# EAGLE design PCA9546 Breakout (EAGLE 9.6.2)
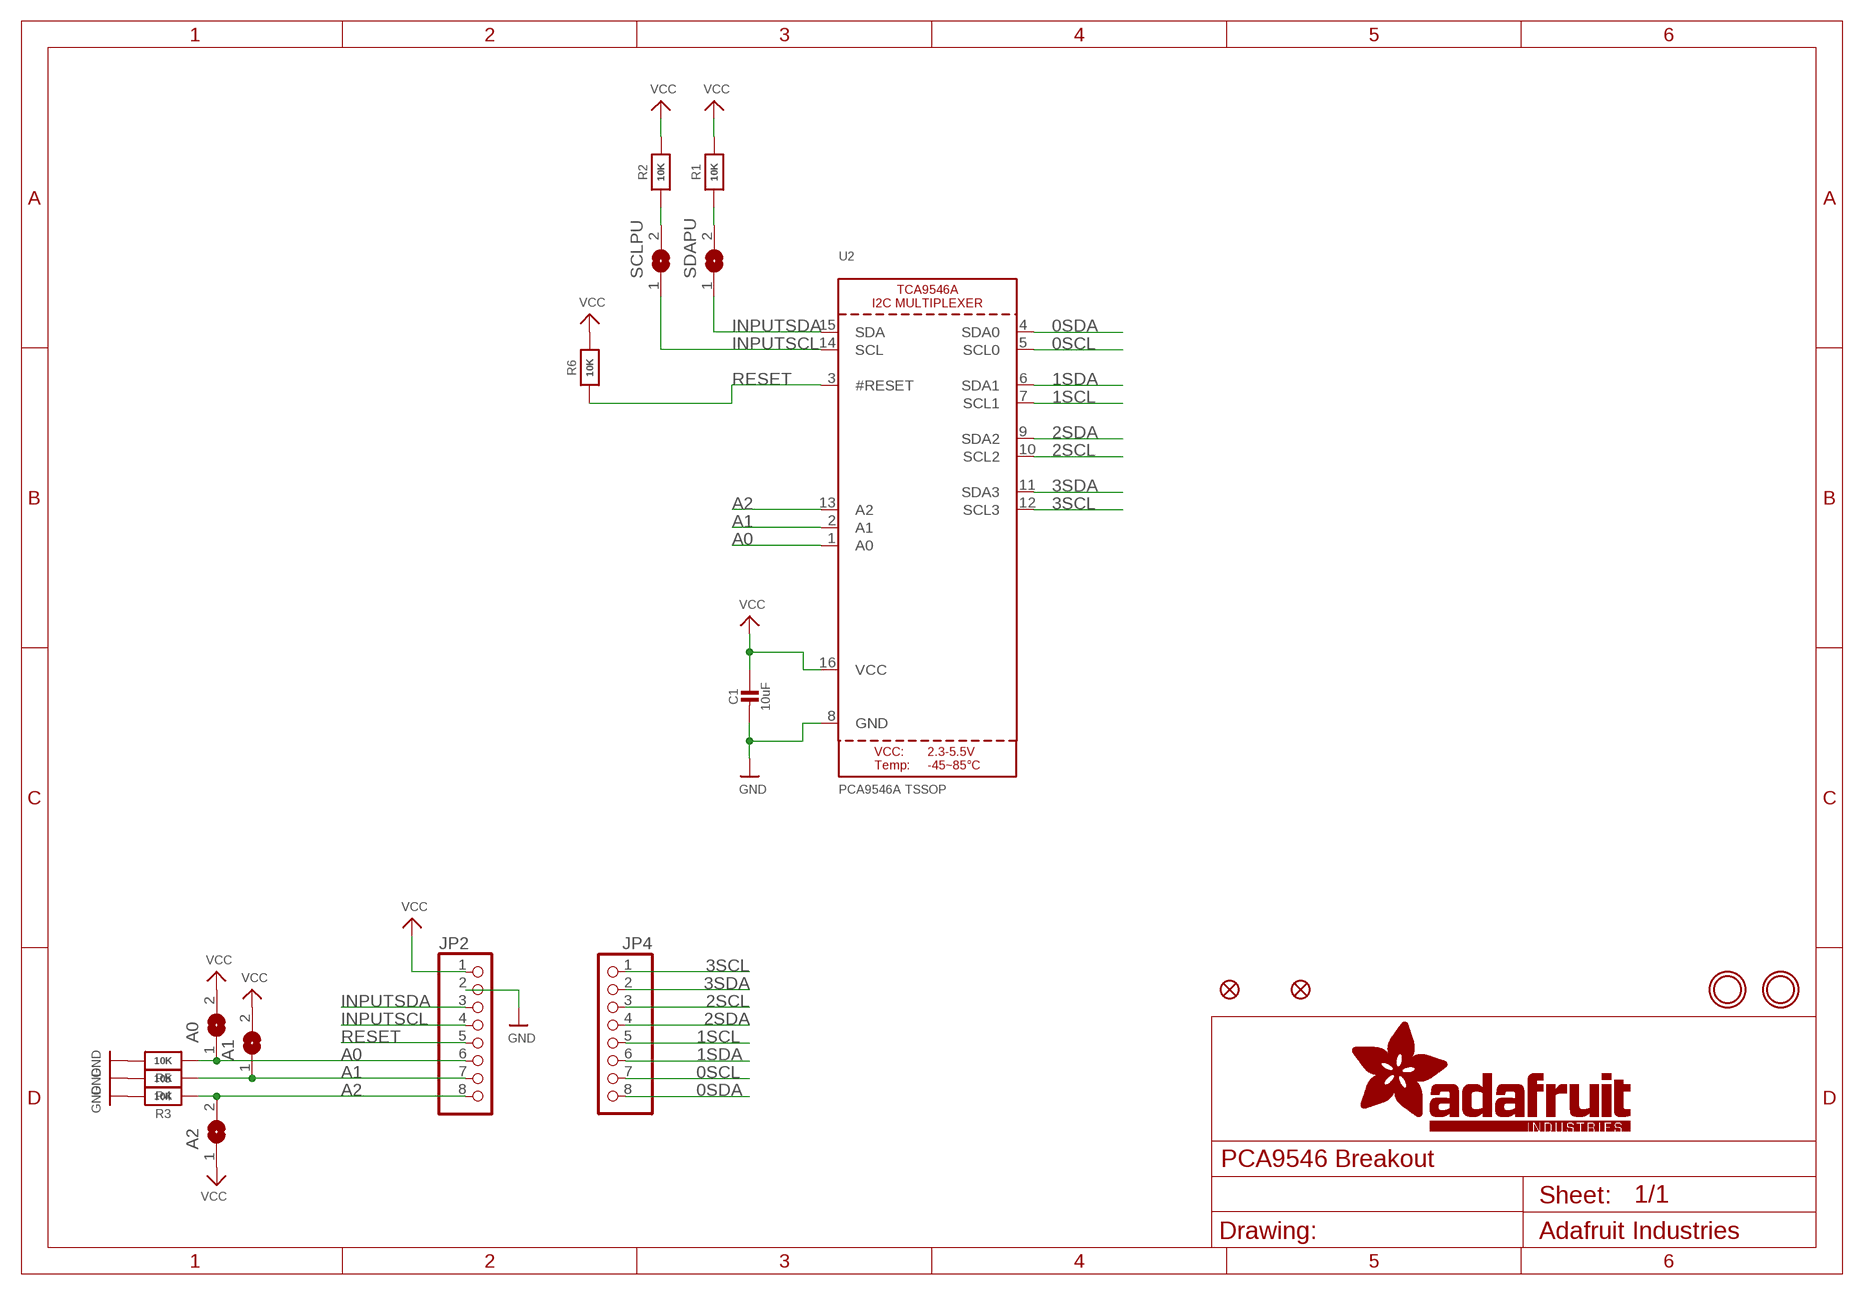
[diagram p0: schematic, sheet 1]

## Parts
A0  SOLDERJUMPER  [SOLDERJUMPER_ARROW_NOPASTE]
A1  SOLDERJUMPER  [SOLDERJUMPER_ARROW_NOPASTE]
A2  SOLDERJUMPER  [SOLDERJUMPER_ARROW_NOPASTE]
C1  10uF  CAP_CERAMIC0805-NOOUTLINE  [0805-NO]
FID1  FIDUCIAL_1MM  [FIDUCIAL_1MM]
FID3  FIDUCIAL_1MM  [FIDUCIAL_1MM]
JP2  HEADER-1X870MIL  [1X08_ROUND_70]
JP4  HEADER-1X870MIL  [1X08_ROUND_70]
R1  10K  RESISTOR_0603_NOOUT  [0603-NO]
R2  10K  RESISTOR_0603_NOOUT  [0603-NO]
R3  10K  RESISTOR_0603_NOOUT  [0603-NO]
R4  10K  RESISTOR_0603_NOOUT  [0603-NO]
R5  10K  RESISTOR_0603_NOOUT  [0603-NO]
R6  10K  RESISTOR_0603_NOOUT  [0603-NO]
SCLPU  SOLDERJUMPERCLOSED  [SOLDERJUMPER_CLOSEDWIRE]
SDAPU  SOLDERJUMPERCLOSED  [SOLDERJUMPER_CLOSEDWIRE]
U2  PCA9546A TSSOP  XCA9546APW  [TSSOP16]
U$4  MOUNTINGHOLE2.5  [MOUNTINGHOLE_2.5_PLATED]
U$5  MOUNTINGHOLE2.5  [MOUNTINGHOLE_2.5_PLATED]

## Nets
0SCL: JP4.7 U2.5(SCL0)
0SDA: JP4.8 U2.4(SDA0)
1SCL: JP4.5 U2.7(SCL1)
1SDA: JP4.6 U2.6(SDA1)
2SCL: JP4.3 U2.10(SCL2)
2SDA: JP4.4 U2.9(SDA2)
3SCL: JP4.1 U2.12(SCL3)
3SDA: JP4.2 U2.11(SDA3)
A0: A0.1 JP2.6 R5.1 U2.1(A0)
A1: A1.1 JP2.7 R4.1 U2.2(A1)
A2: A2.2 JP2.8 R3.1 U2.13(A2)
GND: C1.2 JP2.2 R3.2 R4.2 R5.2 U2.8(GND)
INPUTSCL: JP2.4 SCLPU.1 U2.14(SCL)
INPUTSDA: JP2.3 SDAPU.1 U2.15(SDA)
N$3: R2.1 SCLPU.2
N$4: R1.1 SDAPU.2
RESET: JP2.5 R6.1 U2.3(#RESET)
VCC: A0.2 A1.2 A2.1 C1.1 JP2.1 R1.2 R2.2 R6.2 U2.16(VCC)

## Library data of the parts
A0 A1 A2 = microbuilder:SOLDERJUMPER: SMD Solder JUMPER Solder the two pads together to create a connection, or remove the solder to break it. REFLOW - Use this footprint for solder paste and reflow ovens. WAVE - Use this footprint for hand-soldering (larger pads). CLOSED - Has a trace between the two pads to ensure it is closed by default. The trace needs to be cut to disable the jumper, and can be closed again by creating a solder bridge between the two pads.; BOM: EXCLUDE
C1 = microbuilder:CAP_CERAMIC: Ceramic Capacitors For new designs, use the packages preceded by an '_' character since they are more reliable: The following footprints should be used on most boards: _0402 - Standard footprint for regular board layouts _0603 - Standard footprint for regular board layouts _0805 - Standard footprint for regular board layouts _1206 - Standard footprint for regular board layouts For extremely tight-pitch boards where space is at a premium, the following 'micro-pitch' footprints can be used (smaller pads, no silkscreen outline, etc.): _0402MP - Micro-pitch footprint for very dense/compact boards _0603MP - Micro-pitch footprint for very dense/compact boards _0805MP - Micro-pitch footprint for very dense/compact boards _1206MP - Micro-pitch footprint for very dense/compact boards
FID1 FID3 = microbuilder:FIDUCIAL: Fiducial Alignment Points Various fiducial points for machine vision alignment.; BOM: EXCLUDE
JP2 JP4 = microbuilder:HEADER-1X8: PIN HEADER
R1-R6 = microbuilder:RESISTOR: Resistors For new designs, use the packages preceded by an '_' character since they are more reliable: The following footprints should be used on most boards: _0402 - Standard footprint for regular board layouts _0603 - Standard footprint for regular board layouts _0805 - Standard footprint for regular board layouts _1206 - Standard footprint for regular board layouts For extremely tight-pitch boards where space is at a premium, the following 'micro-pitch' footprints can be used (smaller pads, no silkscreen outline, etc.): _0402MP - Micro-pitch footprint for very dense/compact boards _0603MP - Micro-pitch footprint for very dense/compact boards _0805MP - Micro-pitch footprint for very dense/compact boards _1206MP - Micro-pitch footprint for very dense/compact boards
SCLPU SDAPU = microbuilder:SOLDERJUMPER: SMD Solder JUMPER Solder the two pads together to create a connection, or remove the solder to break it. REFLOW - Use this footprint for solder paste and reflow ovens. WAVE - Use this footprint for hand-soldering (larger pads). CLOSED - Has a trace between the two pads to ensure it is closed by default. The trace needs to be cut to disable the jumper, and can be closed again by creating a solder bridge between the two pads.
U2 = microbuilder:XCA9546A: TCA9548A I2C Multiplexer
U$4 U$5 = adafruit_electromech:MOUNTINGHOLE: Mounting Hole For #2 screws (0.086"/2.18mm width, 0.094"/2.4mm hole) use 2.5mm; BOM: EXCLUDE

## Board
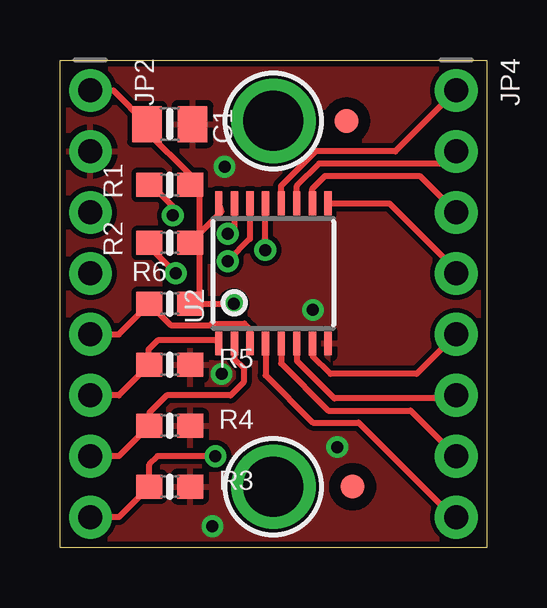
[diagram p1: board, top side]
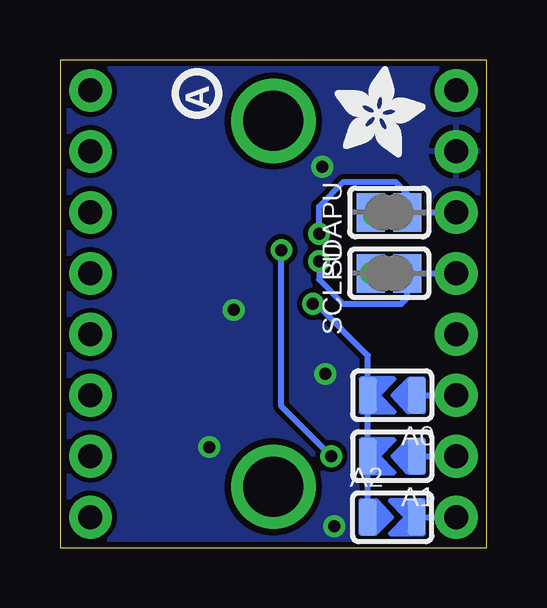
[diagram p2: board, bottom side, seen from below]

Size 17.78 x 20.32 mm. Coordinates in mm from the lower left corner, seen from the top.
Outline: 17.78,0 0,0 0,20.32 17.78,20.32 17.78,0
Copper layers (1*16): Top 0.035mm / dielectric 1.5mm / Bottom 0.035mm
Design rules "adafruit 88": minimum track width 8mil, minimum drill 15.5mil, track to track 8mil, track to pad 8mil, pad to pad 8mil, via to via 8mil, smd to smd 8mil, copper to edge 10mil, drill to drill 8mil, minimum pad ring 10mil, minimum via ring 8mil, stop-mask expansion 2mil, vias tented up to drill 20mil, thermal gap 10mil

### Footprints (pad centres in the part's own frame; a part is rotated, then mirrored left to right if it is on the bottom)
SOLDERJUMPER_ARROW_NOPASTE = smd 0.762 x 1.524: 1 -1.016,0; 2 1.016,0
0805-NO = smd 1.24 x 1.5: 1 -0.95,0; 2 0.95,0
FIDUCIAL_1MM = smd 1 x 1: 1 0,0
1X08_ROUND_70 = drill 1 pad 1.778: 1 -8.89,0; 2 -6.35,0; 3 -3.81,0; 4 -1.27,0; 5 1.27,0; 6 3.81,0; 7 6.35,0; 8 8.89,0
0603-NO = smd 1.075 x 1: 1 -0.85,0; 2 0.85,0
SOLDERJUMPER_CLOSEDWIRE = smd 1.168 x 1.6: 1 -0.762,0; 2 0.762,0 | smd 0.635 x 0.203: WIRE 0,0
TSSOP16 = smd 0.305 x 0.991: 1 -2.275,-2.918; 2 -1.625,-2.918; 3 -0.975,-2.918; 4 -0.325,-2.918; 5 0.325,-2.918; 6 0.975,-2.918; 7 1.625,-2.918; 8 2.275,-2.918; 9 2.275,2.918; 10 1.625,2.918; 11 0.975,2.918; 12 0.325,2.918; 13 -0.325,2.918; 14 -0.975,2.918; 15 -1.625,2.918; 16 -2.275,2.918
MOUNTINGHOLE_2.5_PLATED = drill 2.5 pad 3.2: P$1 0,0

### Placement (x,y rotation side)
A0  3.94,6.35 180 bottom
A1  3.94,3.81 180 bottom
A2  3.94,1.27 0 bottom
C1  4.57,17.65 0 top
FID1  11.94,17.78 0 top
FID3  12.19,2.54 0 top
JP2  1.27,10.16 270 top
JP4  16.51,10.16 270 top
PLABEL0  [PLABEL0]  15.49,19.05 0 top
PLABEL1  [PLABEL1]  15.62,14.1 0 top
PLABEL2  [PLABEL2]  15.49,8.89 0 top
PLABEL3  [PLABEL3]  15.49,3.81 0 top
PLABEL4  [PLABEL4]  15.49,1.27 0 top
PLABEL5  [PLABEL5]  15.49,6.35 0 top
PLABEL6  [PLABEL6]  15.49,11.43 0 top
PLABEL7  [PLABEL7]  15.62,16.51 0 top
PLABEL8  [PLABEL8]  2.29,6.35 0 top
PLABEL9  [PLABEL9]  2.29,3.81 0 top
PLABEL10  [PLABEL10]  2.41,1.27 0 top
PLABEL11  [PLABEL11]  2.29,8.89 0 top
PLABEL12  [PLABEL12]  2.29,11.43 0 top
PLABEL13  [PLABEL13]  2.29,13.97 0 top
PLABEL14  [PLABEL14]  2.41,16.26 0 top
PLABEL15  [PLABEL15]  2.29,19.05 0 top
PLABEL16  [PLABEL16]  9.02,6.22 0 top
PLABEL17  [PLABEL17]  11.18,10.29 90 bottom
PLABEL18  [PLABEL18]  13.97,10.41 90 bottom
PLABEL19  [PLABEL19]  8.13,12.95 90 bottom
PLABEL20  [PLABEL20]  5.84,5.46 90 bottom
PLABEL21  [PLABEL21]  5.84,3.05 90 bottom
PLABEL22  [PLABEL22]  5.84,0.25 90 bottom
R1  4.57,15.11 0 top
R2  4.57,12.7 0 top
R3  4.57,2.54 0 top
R4  4.57,5.08 0 top
R5  4.57,7.62 0 top
R6  4.57,10.16 0 top
SCLPU  4.06,11.43 180 bottom
SDAPU  4.06,13.97 180 bottom
U2  8.89,11.43 0 top
U$4  8.89,2.54 0 top
U$5  8.89,17.78 0 top
U$6  [PCBFEAT-REV-040]  12.06,18.92 270 bottom
U$7  [ADAFRUIT_3.5MM]  6.35,16.26 0 bottom

### Tracks (layer width: path | path; a pad name or v marks a point on that pad's centre or on a via)
0SCL
  Top 0.254: U2.5 9.21,7.68 11.18,5.71 14.61,5.71 JP4.7
0SDA
  Top 0.254: U2.4 8.56,7.18 10.54,5.21 12.45,5.21 16.38,1.27 JP4.8
1SCL
  Top 0.254: U2.7 10.52,8 11.28,7.24 14.86,7.24 JP4.5
1SDA
  Top 0.254: U2.6 9.87,7.79 11.43,6.22 16.38,6.22 JP4.6
2SCL
  Top 0.254: U2.10 10.52,14.96 11.05,15.49 14.99,15.49 JP4.3
2SDA
  Top 0.254: U2.9 13.72,14.35 16.51,11.56 JP4.4
3SCL
  Top 0.254: U2.12 9.21,15.07 10.65,16.51 13.97,16.51 JP4.1
3SDA
  Top 0.254: U2.11 9.87,15.07 10.79,16 16,16 JP4.2
A0
  Top 0.254: JP2.6 2.45,6.35 R5.1 3.68,7.66 3.68,8.26 4.07,8.64 6.49,8.64 U2.1
  Bottom 0.254: A0.1 JP2.6
A1
  Top 0.254: JP2.7 2.45,3.81 R4.1 3.72,5.63 4.45,6.35 7.11,6.35 7.65,6.88 7.65,7.5 7.26,7.88 U2.2
  Bottom 0.254: A1.1 JP2.7
A2  (via drill 0.5)
  Top 0.254: JP2.8 2.45,1.27 R3.1 3.72,3.47 4.06,3.81 v6.48,3.81 | v8.55,12.4 8.55,14.34 U2.13
  Bottom 0.254: v6.48,3.81 8.55,5.89 v8.55,12.4 | A2.2 JP2.8
GND  (via drill 0.5)
  other vias: 10.54,9.91 6.35,0.89 6.73,7.24 11.56,4.19 6.86,15.88
  pour Top: 0,20.32 17.91,20.32 17.91,0 0,0
  pour Bottom: 0,20.32 17.91,20.32 17.91,0 0,0
INPUTSCL  (via drill 0.5)
  Top 0.254: U2.14 7.92,12.87 v6.99,11.94
  Bottom 0.254: v6.99,11.94 6.99,11.18 5.97,10.16 3.56,10.16 3.3,10.41 SCLPU.1 JP2.4
INPUTSDA  (via drill 0.5)
  Top 0.254: U2.15 7.26,13.36 v6.99,13.08
  Bottom 0.254: v6.99,13.08 6.99,14.22 5.97,15.24 3.81,15.24 3.62,15.05 3.3,14.73 SDAPU.1 JP2.3
N$3  (via drill 0.5)
  Top 0.254: R2.1 3.72,12.53 SCLPU.2
  other vias: 4.83,11.43
N$4  (via drill 0.5)
  Top 0.254: R1.1 3.81,15.11 4.7,14.22 v4.7,13.84
  Bottom 0.254: 4.71,13.97 SDAPU.2 | SDAPU.2 4.71,14.08 4.71,14.21 4.57,14.35 4.57,14.48 4.83,14.22 SDAPU.2 | SDAPU.2 v4.7,13.84
RESET
  Top 0.254: JP2.5 2.45,8.89 R6.1 4.61,9.27 6.26,9.27 6.33,9.34 7.68,9.34 7.92,9.1 U2.3
VCC  (via drill 0.5)
  Top 0.254: JP2.1 2.23,19.05 C1.1 3.62,17.33 5.42,15.53 R1.2 5.8,14.73 5.8,13.08 R2.2 | U2.16 6.72,14 R2.2 | R2.2 5.8,12.32 5.8,10.54 R6.2 v7.24,10.16
  Bottom 0.254: A2.1 A1.2 A0.2 4.95,8 7.11,10.16 v7.24,10.16

### Text on the board
Pinguin_tBackup: VIN | SC3 | SD3 | GND | SDA | SC2 | SCL | SD2 | RST | SC1 | A0 | PCA / 9546A | SD1 | A1 | SC0 | A2 | SD0
Pinguin_bBackup: Cut to / disable / pullups | Vin/logic:2.3-5V | PCA9546 4-channel / I2C Expander | A0 | A1 | A2